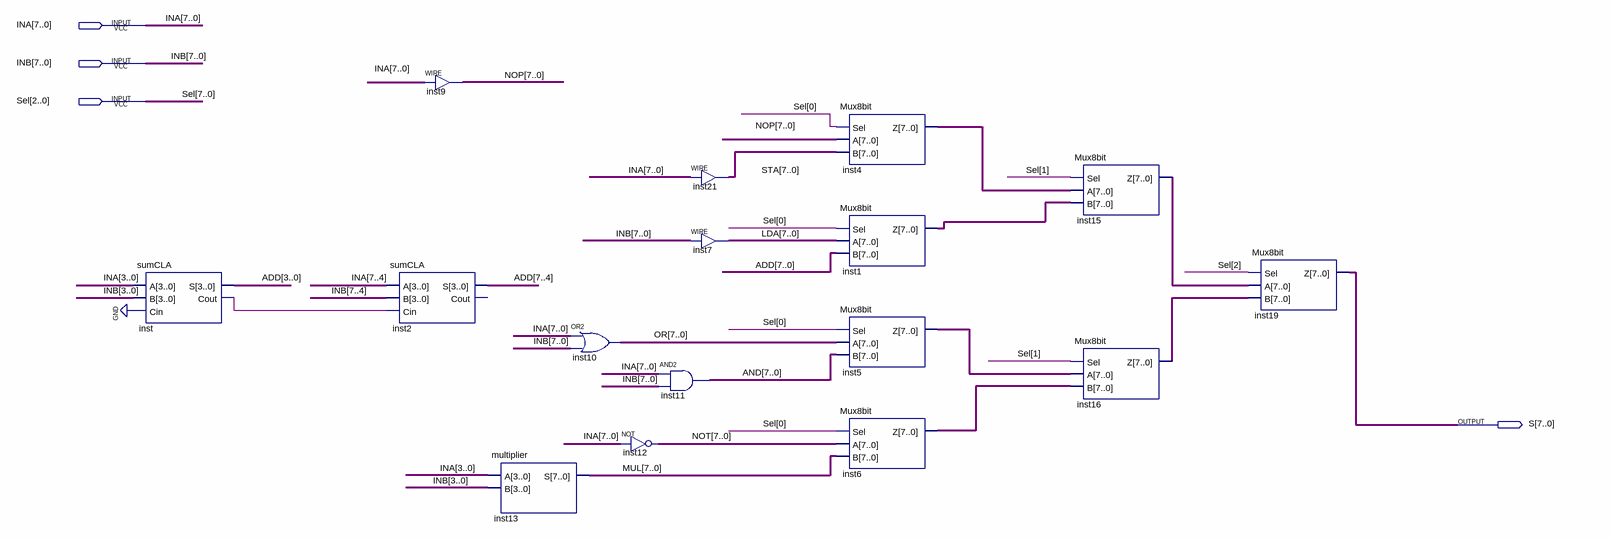
[diagram p0: schematic sheet]
// Quartus schematic ULA.bdf as structural Verilog: 16 symbols, 4 pins
module ULA (
  input  [7:0] INA,
  input  [7:0] INB,
  input  [2:0] Sel,
  output [7:0] S
);

  wire inst_cout;
  wire [7:0] ADD, AND, inst1_z, inst4_z, inst5_z, inst6_z, inst15_z, inst16_z, LDA, MUL, NOP, NOT, OR, STA;

  sumCLA inst (.A(INA[3:0]), .B(INB[3:0]), .Cin(1'b0), .S(ADD[3:0]), .Cout(inst_cout));
  sumCLA inst2 (.A(INA[7:4]), .B(INB[7:4]), .Cin(inst_cout), .S(ADD[7:4]));  // open: Cout
  assign NOP = INA;  // WIRE inst9
  multiplier inst13 (.A(INA[3:0]), .B(INB[3:0]), .S(MUL));
  assign OR = INA | INB;  // OR2 inst10, 8 bits wide
  assign NOT = ~INA;  // NOT inst12, 8 bits wide
  assign STA = INA;  // WIRE inst21
  assign LDA = INB;  // WIRE inst7
  assign AND = INA & INB;  // AND2 inst11, 8 bits wide
  Mux8bit inst4 (.Sel(Sel[0]), .A(NOP), .B(STA), .Z(inst4_z));
  Mux8bit inst1 (.Sel(Sel[0]), .A(LDA), .B(ADD), .Z(inst1_z));
  Mux8bit inst5 (.Sel(Sel[0]), .A(OR), .B(AND), .Z(inst5_z));
  Mux8bit inst6 (.Sel(Sel[0]), .A(NOT), .B(MUL), .Z(inst6_z));
  Mux8bit inst15 (.Sel(Sel[1]), .A(inst4_z), .B(inst1_z), .Z(inst15_z));
  Mux8bit inst16 (.Sel(Sel[1]), .A(inst5_z), .B(inst6_z), .Z(inst16_z));
  Mux8bit inst19 (.Sel(Sel[2]), .A(inst15_z), .B(inst16_z), .Z(S));
endmodule
